# EAGLE design Reflow-controller-ESP32 (EAGLE 9.3.0)
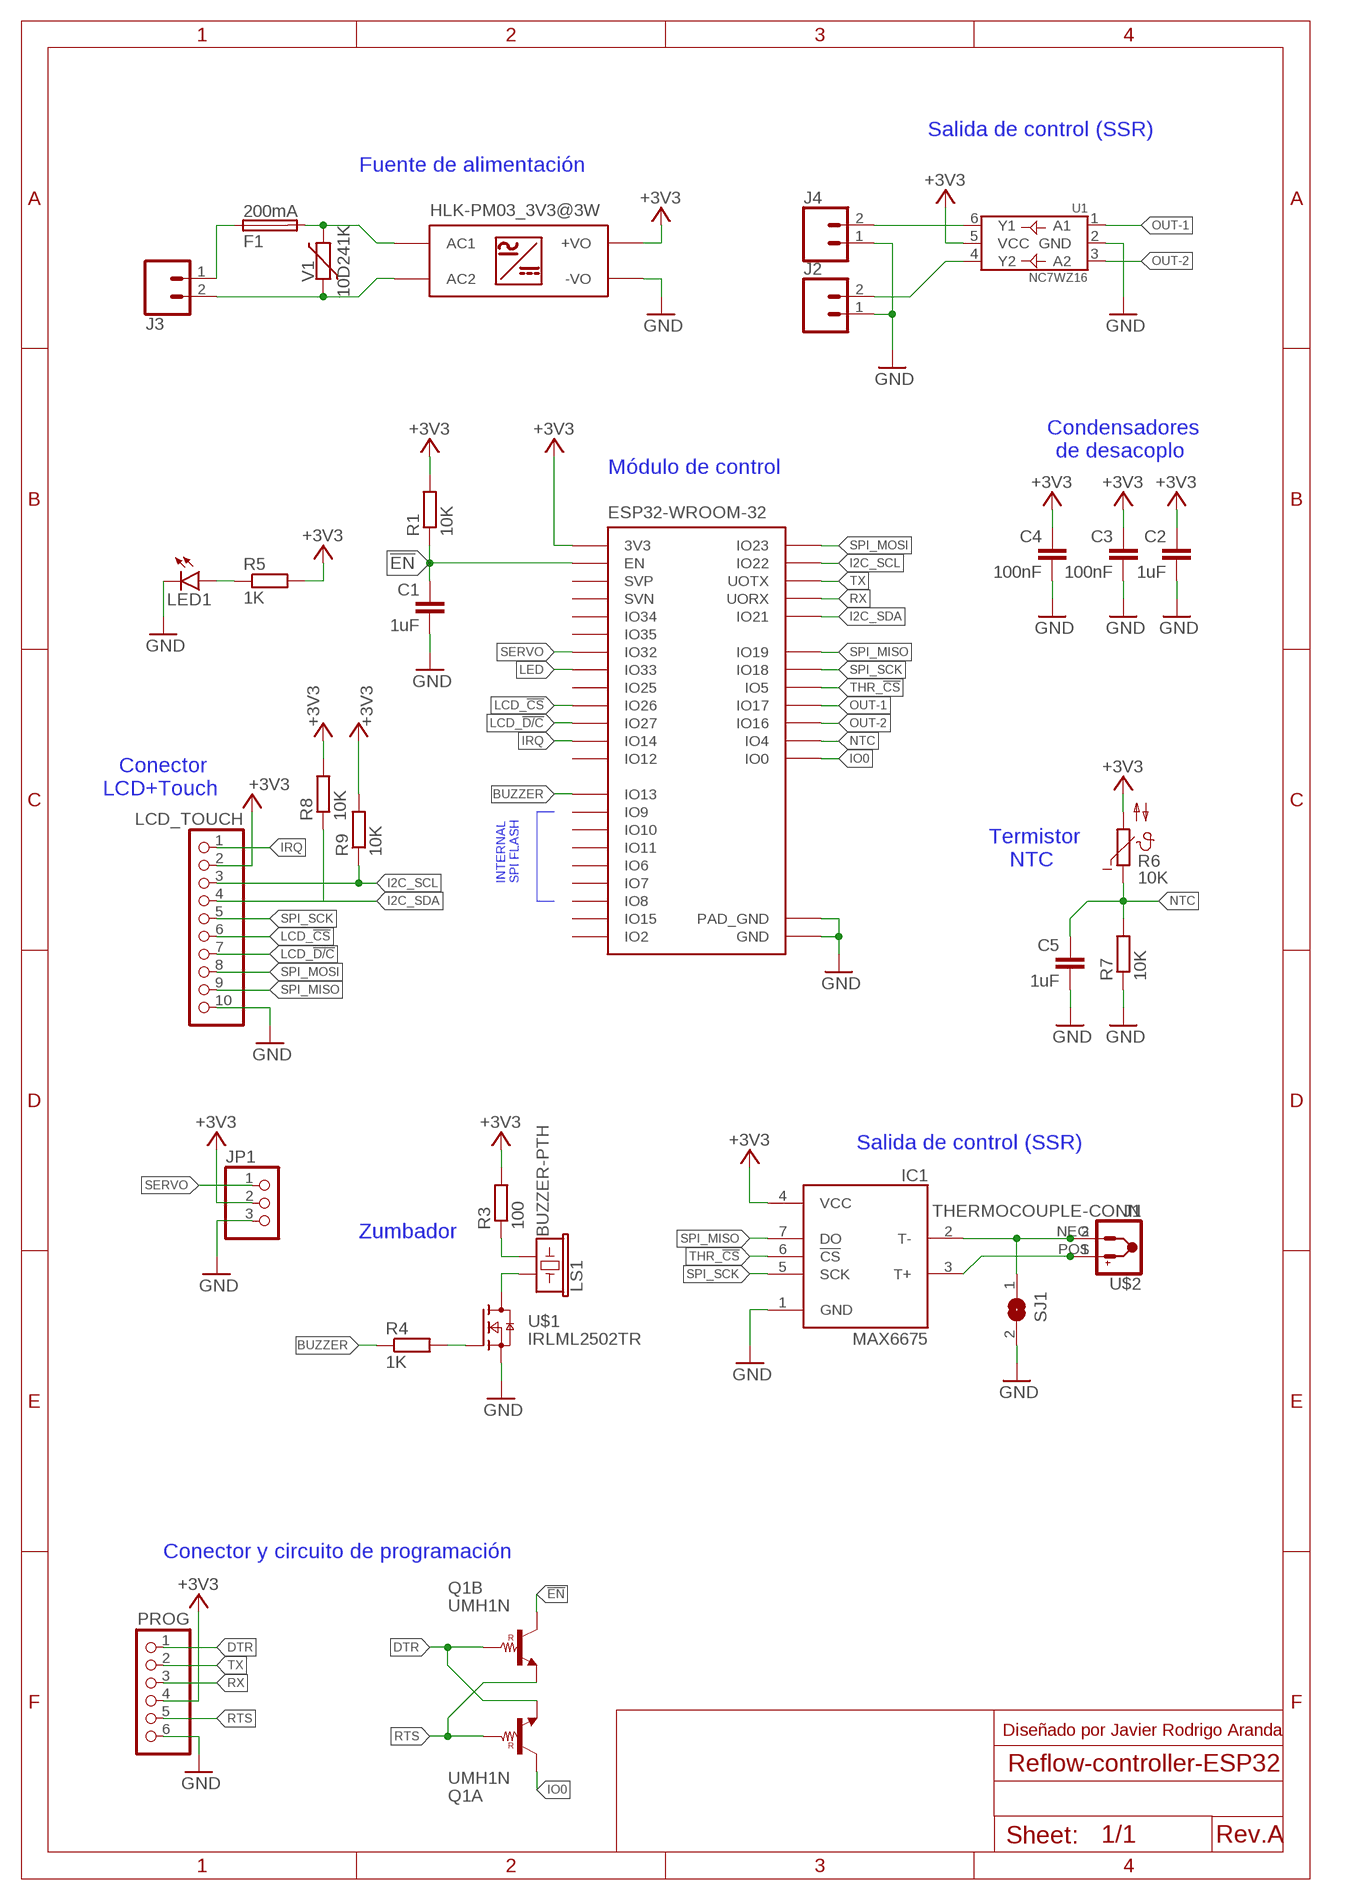
[diagram p0: schematic, sheet 1]

## Parts
C1  1uF  C-EUC0805  [C0805]
C2  1uF  C-EUC0805  [C0805]
C3  100nF  C-EUC0805  [C0805]
C4  100nF  C-EUC0805  [C0805]
C5  1uF  C-EUC0805  [C0805]
ESP32-WROOM-32  ESP32  [ESP32-WROOM-32]
F1  200mA  SH22,5  [SH22,5]
HLK-PM03_3V3@3W  HLK-PM0X  [HLK-PM0X]
IC1  MAX6675  [SO08]
J1  HEADER_01X025MM-BIG  [SCREWTERMINAL-5MM-BIG-BLOCK]
J2  HEADER_01X025MM-BIG  [SCREWTERMINAL-5MM-BIG-BLOCK]
J3  HEADER_01X025MM-BIG  [SCREWTERMINAL-5MM-BIG-BLOCK]
J4  HEADER_01X025MM-BIG  [SCREWTERMINAL-5MM-BIG-BLOCK]
JP1  PINHD-1X3  [1X03]
LCD_TOUCH  PINHD-1X10  [1X10]
LED1  LEDSML1206  [SML1206]
LS1  BUZZER-PTH  [BUZZER-12MM]
PROG  PINHD-1X6  [1X06]
Q1  UMH1N  UMX1N  [UMT6]
R1  10K  R-EU_R0805  [R0805]
R3  100  R-EU_R0805  [R0805]
R4  1K  R-EU_R0805  [R0805]
R5  1K  R-EU_R0805  [R0805]
R6  10K  NTC642-6  [P642]
R7  10K  R-EU_R0805  [R0805]
R8  10K  R-EU_R0805  [R0805]
R9  10K  R-EU_R0805  [R0805]
SJ1  SJ  [SJ]
U1  NC7WZ16  [SC-70-6]
U$1  IRLML2502TR  [SOT23-3]
U$2  THERMOCOUPLE-CONN  [THERMOCOUPLE-ONBOARD-CONN]
V1  10D241K  VARISTOR-7,5  [R-7,5]

## Nets
!EN: C1.1 ESP32-WROOM-32.3(EN) Q1.3(B:C) R1.1
+3V3: C2.1 C3.1 C4.1 ESP32-WROOM-32.2(3V3) HLK-PM03_3V3@3W.P$4(+VO) IC1.4(VCC) JP1.2 LCD_TOUCH.2 PROG.4 R1.2 R3.2 R5.2 R6.2 R8.2 R9.2 U1.5(VCC)
AC+: HLK-PM03_3V3@3W.P$2(AC2) J3.2 V1.1
AC-: F1.2 HLK-PM03_3V3@3W.P$1(AC1) V1.2
BOUT1: J4.2 U1.6(Y1)
BOUT2: J2.2 U1.4(Y2)
BUZZER: ESP32-WROOM-32.16(IO13) R4.1
DTR: PROG.1 Q1.1(A:E) Q1.5(B:B)
GND: C1.2 C2.2 C3.2 C4.2 C5.2 ESP32-WROOM-32.1(GND) ESP32-WROOM-32.15(GND) ESP32-WROOM-32.38(GND) ESP32-WROOM-32.GND(PAD_GND) HLK-PM03_3V3@3W.P$3(-VO) IC1.1(GND) J2.1 J4.1 JP1.3 LCD_TOUCH.10 LED1.C PROG.6 R7.1 SJ1.2 U1.2(GND) U$1.2(S)
I2C_SCL: ESP32-WROOM-32.36(IO22) LCD_TOUCH.3 R9.1
I2C_SDA: ESP32-WROOM-32.33(IO21) LCD_TOUCH.4 R8.1
IO0: ESP32-WROOM-32.25(IO0) Q1.6(A:C)
IRQ: ESP32-WROOM-32.13(IO14) LCD_TOUCH.1
LCD_!CS: ESP32-WROOM-32.11(IO26) LCD_TOUCH.6
LCD_!D/C: ESP32-WROOM-32.12(IO27) LCD_TOUCH.7
LED: ESP32-WROOM-32.9(IO33)
N$2: F1.1 J3.1
N$5: LED1.A R5.1
N$6: IC1.3(T+) J1.1 U$2.POS
N$7: LS1.- R3.1
N$8: LS1.+ U$1.3(D)
N$9: R4.2 U$1.1(G)
N$10: IC1.2(T-) J1.2 SJ1.1 U$2.NEG
NTC: C5.1 ESP32-WROOM-32.26(IO4) R6.1 R7.2
OUT-1: ESP32-WROOM-32.28(IO17) U1.1(A1)
OUT-2: ESP32-WROOM-32.27(IO16) U1.3(A2)
RTS: PROG.5 Q1.2(A:B) Q1.4(B:E)
RX: ESP32-WROOM-32.34(UORX) PROG.3
SERVO: ESP32-WROOM-32.8(IO32) JP1.1
SPI_MISO: ESP32-WROOM-32.31(IO19) IC1.7(DO) LCD_TOUCH.9
SPI_MOSI: ESP32-WROOM-32.37(IO23) LCD_TOUCH.8
SPI_SCK: ESP32-WROOM-32.30(IO18) IC1.5(SCK) LCD_TOUCH.5
THR_!CS: ESP32-WROOM-32.29(IO5) IC1.6(!CS)
TX: ESP32-WROOM-32.35(UOTX) PROG.2
Unconnected: ESP32-WROOM-32.4(SVP) ESP32-WROOM-32.5(SVN) ESP32-WROOM-32.6(IO34) ESP32-WROOM-32.7(IO35) ESP32-WROOM-32.10(IO25) ESP32-WROOM-32.14(IO12) ESP32-WROOM-32.17(IO9) ESP32-WROOM-32.18(IO10) ESP32-WROOM-32.19(IO11) ESP32-WROOM-32.20(IO6) ESP32-WROOM-32.21(IO7) ESP32-WROOM-32.22(IO8) ESP32-WROOM-32.23(IO15) ESP32-WROOM-32.24(IO2)

## Notes on the sheet
- Salida de control (SSR)
- Fuente de alimentación
- Condensadores
  de desacoplo
- Módulo de control
- Conector
  LCD+Touch
- Termistor
  NTC
- INTERNAL
  SPI FLASH
- Salida de control (SSR)
- Zumbador
- Conector y circuito de programación
- Diseñado por Javier Rodrigo Aranda
- Rev.A

## Library data of the parts
C1-C5 = rcl:C-EU: CAPACITOR, European symbol; SPICEPREFIX: C
ESP32-WROOM-32 = jrodrigo:ESP32
F1 = fuse:SH22,5: FUSE HOLDER grid 22,5 mm, OGN0031 8201, Schurter (Buerklin); MF: SCHURTER; MPN: 0031.8201; OC_FARNELL: 1162740; OC_NEWARK: 96F8317
HLK-PM03_3V3@3W = jrodrigo:HLK-PM0X: Hi-Link Power Supply HLK-PM01, HLK-PM02, HLK-PM03, ...
IC1 = jrodrigo:MAX6675
J1-J4 = jrodrigo:HEADER_01X02: Based on Sparkfun part with extra footprints
JP1 = pinhead:PINHD-1X3: PIN HEADER
LCD_TOUCH = pinhead:PINHD-1X10: PIN HEADER
LED1 = led:LED: LED OSRAM: - CHIPLED LG R971, LG N971, LY N971, LG Q971, LY Q971, LO R971, LY R971 LH N974, LH R974 LS Q976, LO Q976, LY Q976 LO Q996 - Hyper CHIPLED LW Q18S LB Q993, LB Q99A, LB R99A - SideLED LS A670, LO A670, LY A670, LG A670, LP A670 LB A673, LV A673, LT A673, LW A673 LH A674 LY A675 LS A676, LA A676, LO A676, LY A676, LW A676 LS A679, LY A679, LG A679 - Hyper Micro SIDELED® LS Y876, LA Y876, LO Y876, LY Y876 LT Y87S - SmartLED LW L88C, LW L88S LB L89C, LB L89S, LG L890 LS L89K, LO L89K, LY L89K LS L896, LA L896, LO L896, LY L896 - TOPLED LS T670, LO T670, LY T670, LG T670, LP T670 LSG T670, LSP T670, LSY T670, LOP T670, LYG T670 LG T671, LOG T671, LSG T671 LB T673, LV T673, LT T673, LW T673 LH T674 LS T676, LA T676, LO T676, LY T676, LB T676, LH T676, LSB T676, LW T676 LB T67C, LV T67C, LT T67C, LS T67K, LO T67K, LY T67K, LW E67C LS E67B, LA E67B, LO E67B, LY E67B, LB E67C, LV E67C, LT E67C LW T67C LS T679, LY T679, LG T679 LS T770, LO T770, LY T770, LG T770, LP T770 LB T773, LV T773, LT T773, LW T773 LH T774 LS E675, LA E675, LY E675, LS T675 LS T776, LA T776, LO T776, LY T776, LB T776 LHGB T686 LT T68C, LB T68C - Hyper Mini TOPLED® LB M676 - Mini TOPLED Santana® LG M470 LS M47K, LO M47K, LY M47K Source: http://www.osram.convergy.de LUXEON: - LUMILED® LXK2-PW12-R00, LXK2-PW12-S00, LXK2-PW14-U00, LXK2-PW14-V00 LXK2-PM12-R00, LXK2-PM12-S00, LXK2-PM14-U00 LXK2-PE12-Q00, LXK2-PE12-R00, LXK2-PE12-S00, LXK2-PE14-T00, LXK2-PE14-U00 LXK2-PB12-K00, LXK2-PB12-L00, LXK2-PB12-M00, LXK2-PB14-N00, LXK2-PB14-P00, LXK2-PB14-Q00 LXK2-PR12-L00, LXK2-PR12-M00, LXK2-PR14-Q00, LXK2-PR14-R00 LXK2-PD12-Q00, LXK2-PD12-R00, LXK2-PD12-S00 LXK2-PH12-R00, LXK2-PH12-S00 LXK2-PL12-P00, LXK2-PL12-Q00, LXK2-PL12-R00 Source: www.luxeon.com KINGBRIGHT: KA-3528ASYC Source: www.kingbright.com
LS1 = SparkFun-Electromechanical:BUZZER: Buzzer Small round buzzers that operate around the audible 2kHz range. You can use these as speakers to create simple music or user interfaces. Variant Overview: PTH - Mini Speaker - PC Mount 12mm 2.048kHz <https://www.sparkfun.com/products/7950> PTH_KIT - Mini Speaker - PC Mount 12mm 2.048kHz <https://www.sparkfun.com/products/7950> KIT simplifies soldering by adding stop mask to one side of the pads. PTH_NO_SILK - Mini Speaker - PC Mount 12mm 2.048kHz <https://www.sparkfun.com/products/7950> No silkscreen indicator of buzzer outline. PTH_KIT_NO_SILK - Mini Speaker - PC Mount 12mm 2.048kHz <https://www.sparkfun.com/products/7950> KIT package w/o silkscreen SMD - Buzzer Audio Magnetic (CCV-084B16) SMD buzzer used on, e.g. the LilyPad Buzzer <https://www.sparkfun.com/products/8463> and RFID USB Reader <https://www.sparkfun.com/products/9963>. SMD_KIT - Buzzer Audio Magnetic (CCV-084B16) SMD Buzzer with elongated pins to make soldering easier. Used on the SparkFun Simon Says - Surface Mount Soldering Kit <https://www.sparkfun.com/products/10935>.; PROD_ID: COMP-08253; SF_SKU: COM-07950
PROG = pinhead:PINHD-1X6: PIN HEADER
Q1 = jrodrigo:UMX1N: General purpose transistors (dual transistors) Two 2SC2412K chips in a EMT or UMT or SMT package. Source: http://www.rohm.com/products/databook/tr/pdf/umx1n.pdf; MPN: UMX1NTN; OC_FARNELL: 1680410; OC_NEWARK: 40P3417
R1 R3-R5 R7-R9 = rcl:R-EU_: RESISTOR, European symbol; SPICEPREFIX: R
R6 = ptc-ntc:NTC642-6: PHILIPS NTC; OC_FARNELL: unknown; OC_NEWARK: unknown
SJ1 = jumper:SJ: SMD solder JUMPER
U1 = jrodrigo:NC7WZ16
U$1 = jrodrigo:IRLML2502TR
U$2 = jrodrigo:THERMOCOUPLE-CONN
V1 = varistor:VARISTOR: VARISTOR

## Board
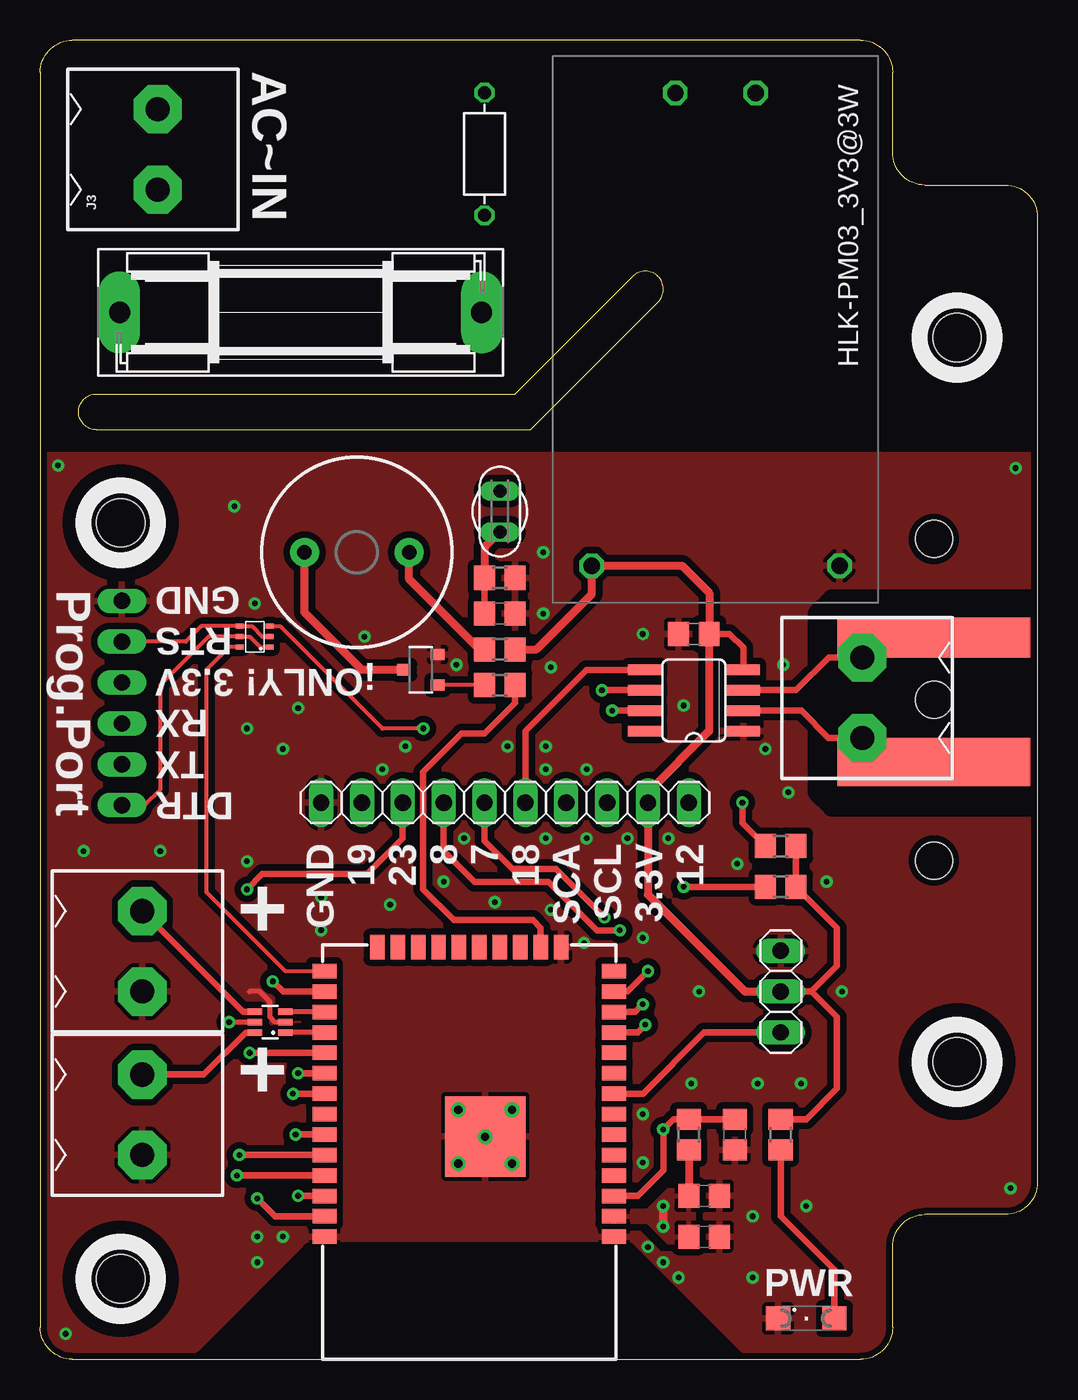
[diagram p1: board, top side]
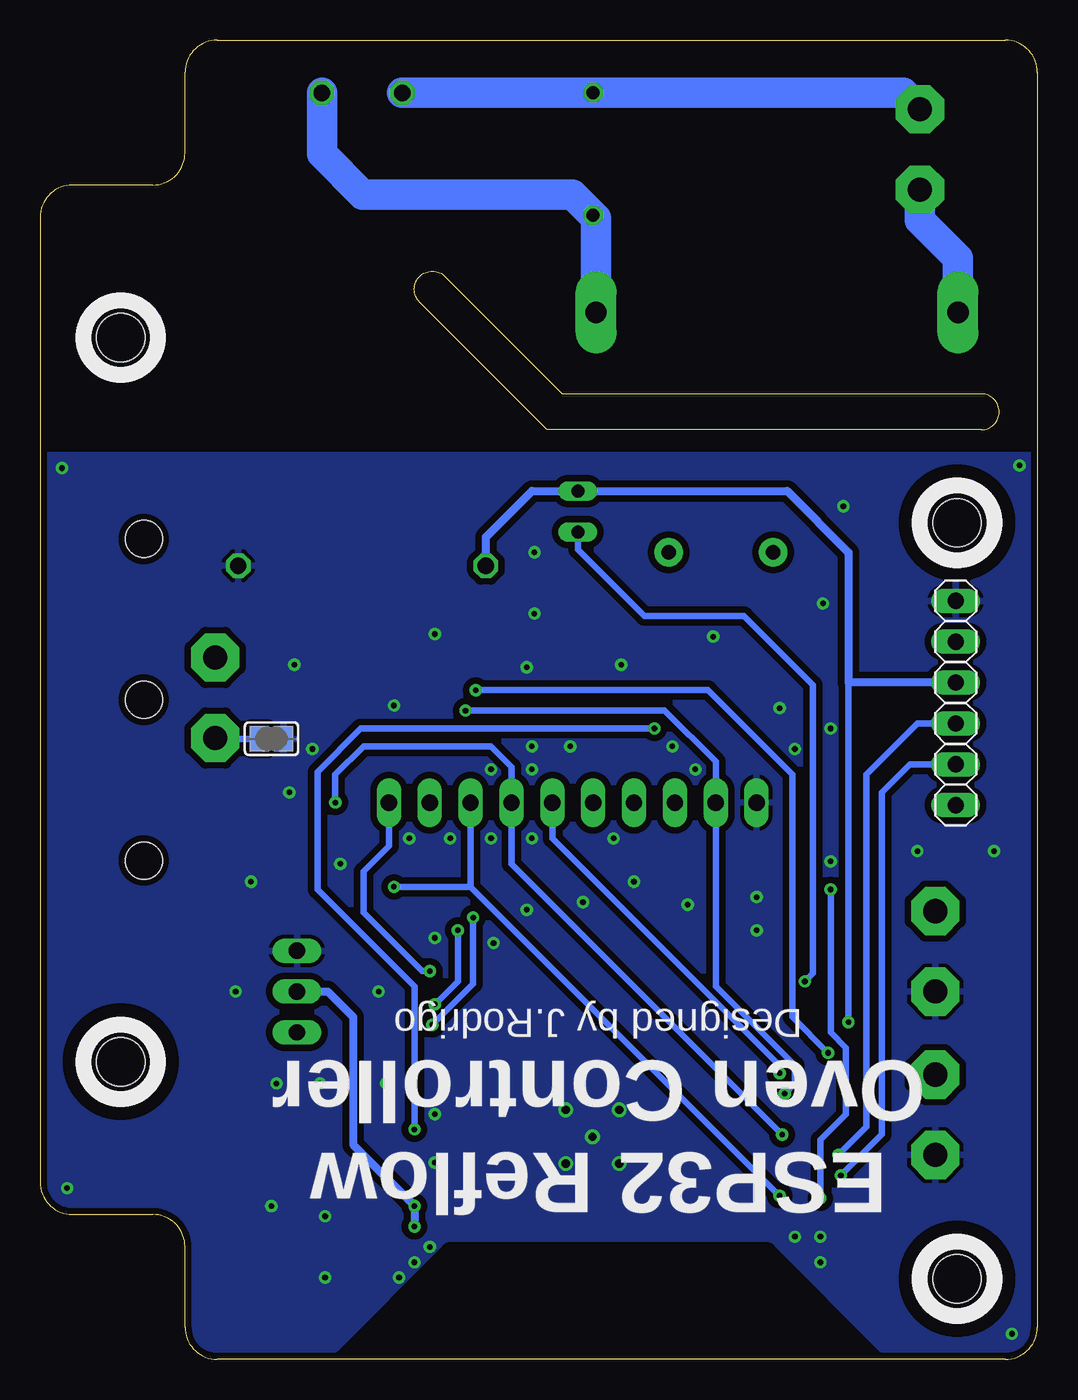
[diagram p2: board, bottom side, seen from below]

Size 62 x 82 mm. Coordinates in mm from the lower left corner, seen from the top.
Outline: 2,0 51,0 arc90 53,2 53,7 arc-90 55,9 60,9 arc90 62,11 62,71 arc90 60,73 55,73 arc-90 53,75 53,80 arc90 51,82 2,82 arc90 0,80 0,2 arc90 2,0
Outline: 3.49,60.01 29.53,60.01 36.83,67.31 arc-180 38.42,65.72 30.48,57.78 3.49,57.78 arc-180 3.49,60.01
Copper layers (1*16): Top 0.035mm / dielectric 1.5mm / Bottom 0.035mm
Design rules "Piwae_PCBway": minimum track width 4mil, minimum drill 6mil, track to track 8mil, track to pad 8mil, pad to pad 8mil, via to via 8mil, smd to smd 8mil, copper to edge 10mil, drill to drill 8mil, minimum pad ring 8mil, minimum via ring 8mil, stop-mask expansion 4mil, vias tented up to drill 25mil, thermal gap 10mil
Holes 3 mm at 57,63.5 57,18.5 5,5 5,52
tRestrict: area 2,2 to 8,8; area 2,49 to 8,55; area 54,15.5 to 60,21.5; 8 lines
bRestrict: area 2,2 to 8,8; area 2,49 to 8,55; area 54,15.5 to 60,21.5; 3 lines

### Footprints (pad centres in the part's own frame; a part is rotated, then mirrored left to right if it is on the bottom)
C0805 = smd 1.3 x 1.5: 1 -0.95,0; 2 0.95,0
ESP32-WROOM-32 = smd 1.5 x 0.9: 1 -9,6.985; 2 -9,5.715; 3 -9,4.445; 4 -9,3.175; 5 -9,1.905; 6 -9,0.635; 7 -9,-0.635; 8 -9,-1.905; 9 -9,-3.175; 10 -9,-4.445; 11 -9,-5.715; 12 -9,-6.985; 13 -9,-8.255; 14 -9,-9.525; 25 9,-9.525; 26 9,-8.255; 27 9,-6.985; 28 9,-5.715; 29 9,-4.445; 30 9,-3.175; 31 9,-1.905; 32 9,-0.635; 33 9,0.635; 34 9,1.905; 35 9,3.175; 36 9,4.445; 37 9,5.715; 38 9,6.985 | smd 0.9 x 1.5: 15 -5.715,-11.015; 16 -4.445,-11.015; 17 -3.175,-11.015; 18 -1.905,-11.015; 19 -0.635,-11.015; 20 0.635,-11.015; 21 1.905,-11.015; 22 3.175,-11.015; 23 4.445,-11.015; 24 5.715,-11.015 | smd 5 x 5: GND -1,0.755
SH22,5 = drill 1.321 pad 2.54 long: 1 -11.252,0; 2 11.252,0
HLK-PM0X = drill 1.016 octagon: P$1 -14.7,2.5; P$2 -14.7,-2.5; P$3 14.7,7.7; P$4 14.7,-7.7
SO08 = smd 0.66 x 2.032: 1 -1.905,-3.073; 2 -0.635,-3.073; 3 0.635,-3.073; 4 1.905,-3.073; 5 1.905,3.073; 6 0.635,3.073; 7 -0.635,3.073; 8 -1.905,3.073
SCREWTERMINAL-5MM-BIG-BLOCK = drill 1.5 pad 3 octagon: 1 0,0; 2 5,0
1X03 = drill 1.016 long: 1 -2.54,0; 2 0,0; 3 2.54,0
1X10 = drill 1.016 long: 1 -11.43,0; 2 -8.89,0; 3 -6.35,0; 4 -3.81,0; 5 -1.27,0; 6 1.27,0; 7 3.81,0; 8 6.35,0; 9 8.89,0; 10 11.43,0
SML1206 = smd 1.5 x 1.5: A 1.75,0; C -1.75,0
BUZZER-12MM = drill 0.9 pad 1.778: + 3.25,0; - -3.25,0
1X06 = drill 1.016 long: 1 -6.35,0; 2 -3.81,0; 3 -1.27,0; 4 1.27,0; 5 3.81,0; 6 6.35,0
UMT6 = smd 0.5 x 0.3: 1 -0.925,0.65; 2 -0.925,0; 3 -0.925,-0.65; 4 0.925,-0.65; 5 0.925,0; 6 0.925,0.65
R0805 = smd 1.3 x 1.5: 1 -0.95,0; 2 0.95,0
P642 = drill 0.813 long: 1 -1.27,0; 2 1.27,0
SJ = smd 1.168 x 1.6: 1 -0.762,0; 2 0.762,0
SC-70-6 = smd 0.9 x 0.4: 1 -0.95,0.65; 2 -0.95,0; 3 -0.95,-0.65; 4 0.95,-0.65; 5 0.95,0; 6 0.95,0.65
SOT23-3 = smd 0.7 x 0.85: 1 -0.95,-1.05; 2 0.95,-1.05; 3 0,1.05
THERMOCOUPLE-ONBOARD-CONN = smd 3 x 12: NEG -3.875,0 | smd 2.5 x 12: POS 3.875,0 | hole 2.3: 0,0; 10,0; -10,0
R-7,5 = drill 0.813 octagon: 1 -3.81,0; 2 3.81,0

### Placement (x,y rotation side)
C1  43.18,13.97 270 top
C2  41.27,7.62 0 top
C3  41.27,10.16 0 top
C4  40.64,45.09 180 top
C5  28.57,46.35 0 top
ESP32-WROOM-32  26.67,14.61 180 top
F1  16.19,65.09 0 top
HLK-PM03_3V3@3W  41.99,64.03 270 top
IC1  40.64,40.96 90 top
J1  51.12,43.62 270 top
J2  6.35,22.86 90 top
J3  7.3,72.71 90 top
J4  6.35,12.7 90 top
JP1  46.04,22.86 90 top
LCD_TOUCH  28.89,34.61 180 top
LED1  47.62,2.54 0 top
LS1  19.68,50.16 180 top
PROG  5.08,40.8 90 bottom
Q1  13.34,44.93 180 top
R1  40.32,13.97 270 top
R3  28.57,44.13 0 top
R4  28.57,41.91 180 top
R5  46.04,13.97 90 top
R6  28.57,52.7 90 top
R7  28.57,48.58 180 top
R8  46.04,31.91 0 top
R9  46.04,29.37 0 top
SJ1  47.62,38.58 0 bottom
U1  14.29,20.95 180 top
U$1  23.65,42.86 90 top
U$2  55.56,41 90 top
V1  27.62,74.93 270 top

### Tracks (layer width: path | path; a pad name or v marks a point on that pad's centre or on a via)
!EN  (via drill 0.35)
  Top 0.254: Q1.3 14.91,45.58 21.27,39.21 v23.81,39.21
  Top 0.406: C1.1 R1.1 39.37,14.92 v38.73,14.29 38.73,11.75 37.15,10.16 ESP32-WROOM-32.3
  Bottom 0.406: v23.81,39.21 42.07,39.21 44.77,36.51 44.77,29.21 38.73,23.18 v38.73,14.29
+3V3  (via drill 0.35)
  Top 0.305: U1.5 v11.75,20.95
  Top 0.406: IC1.4 43.71,44.23 42.86,45.09 C4.1 | R1.2 | 47.94,22.86 49.53,21.27 49.53,16.83 47.62,14.92 R5.2 | JP1.2 47.94,22.86 | 47.94,22.86 49.53,24.45 49.53,26.83 R9.2 R8.2
  Top 0.508: R3.2 30.84,44.13 34.29,47.58 HLK-PM03_3V3@3W.P$4 39.89,49.33 41.59,47.62 C4.1 41.59,39.05 37.78,35.24 LCD_TOUCH.2 37.78,28.89 43.81,22.86 JP1.2 | R1.2 C3.1 | v38.73,8.26 v38.73,9.53
  Bottom 0.406: 11.75,42.07 v11.75,20.95
  Bottom 0.508: JP1.2 44.13,22.86 42.55,21.27 42.55,13.34 v38.73,9.53 v38.73,8.26 | PROG.4 11.75,42.07 11.75,50.16 15.56,53.98 R6.2 31.43,53.98 34.29,51.12 HLK-PM03_3V3@3W.P$4
  pour Top: 35.56,8.57 37.78,8.57 39.05,7.3 40.64,7.3 40.64,10.48 39.05,10.48 37.78,9.21 35.56,9.21
AC+
  Bottom 1.905: J3.2 8.34,78.74 V1.1 27.64,78.73 HLK-PM03_3V3@3W.P$2
AC-
  Bottom 1.905: F1.2 27.45,70.94 V1.2 28.89,72.39 41.95,72.39 44.49,74.93 HLK-PM03_3V3@3W.P$1
BOUT1
  Top 0.406: U1.6 12.77,20.3 10.16,17.7 J4.2
BOUT2
  Top 0.406: U1.4 12.61,21.61 J2.2
BUZZER
  Top 0.406: R4.1 29.52,40.8 27.62,38.89 26.19,38.89 23.81,36.51 23.81,29.21 25.72,27.3 30.64,27.3 31.11,26.83 ESP32-WROOM-32.16
DTR
  Top 0.254: Q1.1 13.67,44.28 13.02,44.93 Q1.5 10.48,44.93 7.46,41.91 7.46,35.4 6.51,34.45 PROG.1
GND  (via drill 0.35, 0.51)
  Top 0.305: U1.2 14.61,20.95 14.29,21.27 14.29,22.23 13.65,22.86 13.02,22.86
  Bottom 0.305: 46.99,38.58 48.26,38.58
  other vias: 26,12.17 29.33,12.17 29.33,15.5 26,15.5 27.66,13.83 31.27,46.35 31.27,50.16 33.97,32.38 31.43,32.38 36.51,32.38 33.97,36.67 31.43,36.67 21.27,36.67 22.7,38.1 29.05,38.1 31.43,38.1 28.26,28.42 31.75,27.94 15.08,7.62 13.49,7.62 13.49,6.03 37.78,6.99 38.73,6.03 39.69,5.08 47.62,9.53 44.29,8.89 44.29,5.08 40.48,17.14 44.61,17.14 47.31,17.14 37.47,15.24 37.47,12.22 37.47,26.19 49.85,22.86 48.9,29.69 46.51,35.24 45.09,37.94 40.01,40.64 37.47,45.09 31.75,43.02 13.34,46.99 12.06,53.02 1.11,55.56 1.59,1.59 60.33,10.64 60.64,55.4 46.2,43.18 7.46,31.59 2.7,31.59 26.35,32.38 21.75,28.26 17.46,28.73 17.46,26.67 12.86,30.96 12.86,39.21 15.08,37.94 16.03,40.48 20.16,44.93 25.88,43.18 43.34,30.8 39.05,32.38 40.96,22.86 25.08,29.69 33.81,25.88
  pour Top (isolate 0.406, rank 2): 0,0 0,56.2 61.91,56.2 61.91,9.53 52.39,0
  pour Bottom (isolate 0.406, rank 2): 0,0 0,56.2 61.91,56.2 61.91,9.84 52.07,0
I2C_SCL  (via drill 0.35)
  Top 0.406: R9.1 v40.01,29.37 | v16.03,10.16 ESP32-WROOM-32.36
  Bottom 0.406: LCD_TOUCH.3 35.24,29.37 | 35.24,29.37 v16.03,10.16 | v40.01,29.37 35.24,29.37
I2C_SDA  (via drill 0.35)
  Top 0.406: R8.1 43.66,33.34 v43.66,34.61 | v15.88,13.97 ESP32-WROOM-32.33
  Bottom 0.406: v15.88,13.97 32.7,30.8 LCD_TOUCH.4 32.7,36.83 33.97,38.1 41.91,38.1 43.66,36.35 v43.66,34.61
IO0
  Top 0.254: Q1.6 11.73,44.28 10.32,42.86 10.32,29.05 15.24,24.13 ESP32-WROOM-32.25
IRQ  (via drill 0.35)
  Top 0.406: ESP32-WROOM-32.13 36.51,22.86 v37.78,24.13
  Bottom 0.406: LCD_TOUCH.1 40.32,31.91 41.91,30.32 41.91,27.78 38.26,24.13 v37.78,24.13
LCD_!CS  (via drill 0.35)
  Top 0.406: ESP32-WROOM-32.11 37.15,20.32 v37.62,20.8 | LCD_TOUCH.6 27.62,32.23 29.37,30.48 32.07,30.48 v35.08,27.46
  Bottom 0.406: v37.62,20.8 35.08,23.34 v35.08,27.46
LCD_!D/C  (via drill 0.35)
  Top 0.406: ESP32-WROOM-32.12 36.99,21.59 v37.47,22.07 | v36.04,26.67 34.61,26.67 31.59,29.69 26.99,29.69 25.08,31.59 LCD_TOUCH.7
  Bottom 0.406: v37.47,22.07 36.04,23.5 v36.04,26.67
N$2
  Bottom 1.905: J3.1 7.3,70.8 4.94,68.44 F1.1
N$5
  Top 0.406: R5.1 46.04,8.89 49.38,5.55 LED1.A
N$6
  Top 0.305: U$2.POS 52.37,44.88 J1.1
  Top 0.406: IC1.3 46.99,41.59 49.02,43.62 J1.1
N$7
  Top 0.508: R3.1 27.3,44.13 22.93,48.5 LS1.-
N$8
  Top 0.508: U$1.3 20,42.86 16.43,46.43 LS1.+
N$9
  Top 0.254: R4.2 27.61,41.93 U$1.1
N$10
  Top 0.305: U$2.NEG 52.61,37.12 J1.2
  Top 0.406: IC1.2 47.31,40.32 49.01,38.62 J1.2
  Bottom 0.406: SJ1.1 51.07,38.58 J1.2
NTC  (via drill 0.35)
  Top 0.406: R7.2 C5.1 | v14.46,23.5 15.09,22.86 ESP32-WROOM-32.26
  Top 0.508: R6.1 27.62,50.48 R7.2
  Bottom 0.406: R6.1 28.57,50.32 24.45,46.2 18.26,46.2 13.97,41.91 13.97,23.98 v14.46,23.5
OUT-1
  Top 0.305: U1.1 15.25,20.32 ESP32-WROOM-32.28
OUT-2
  Top 0.305: ESP32-WROOM-32.27 17.66,21.61 U1.3
RTS
  Top 0.254: Q1.2 13.81,44.93 13.16,45.58 Q1.4 10.02,45.58 9.05,44.61 PROG.5
RX  (via drill 0.35)
  Top 0.406: v12.38,12.7 ESP32-WROOM-32.34
  Bottom 0.406: PROG.3 7.46,39.53 10.64,36.35 10.64,14.45 v12.38,12.7
SERVO
  Top 0.406: ESP32-WROOM-32.8 37.47,16.51 41.27,20.32 JP1.1
SPI_MISO  (via drill 0.35)
  Top 0.406: IC1.7 v35.56,40.32 | v15.72,16.51 ESP32-WROOM-32.31
  Bottom 0.406: v35.56,40.32 23.18,40.32 20,37.15 LCD_TOUCH.9 20,23.18 15.08,18.26 15.08,17.14 v15.72,16.51
SPI_MOSI  (via drill 0.35)
  Top 0.406: v12.86,29.21 13.81,30.16 20.32,30.16 22.54,32.38 LCD_TOUCH.8 | v13.49,10 14.61,8.89 ESP32-WROOM-32.37
  Bottom 0.406: v12.86,29.21 12.86,20.32 11.91,19.37 11.91,15.24 13.49,13.65 v13.49,10
SPI_SCK  (via drill 0.35)
  Top 0.406: IC1.5 33.97,42.86 30.16,39.05 LCD_TOUCH.5 | v16.03,17.78 ESP32-WROOM-32.30
  Bottom 0.406: LCD_TOUCH.5 30.16,32.38 16.03,18.26 v16.03,17.78
THR_!CS  (via drill 0.35)
  Top 0.406: IC1.6 v34.92,41.59 | v13.02,19.05 ESP32-WROOM-32.29
  Bottom 0.406: v34.92,41.59 20.48,41.59 15.24,36.35 15.24,21.27 v13.02,19.05
TX  (via drill 0.35)
  Top 0.406: v12.22,11.43 ESP32-WROOM-32.35
  Bottom 0.406: PROG.2 7.94,36.99 9.68,35.24 9.68,13.97 v12.22,11.43

### Text on the board
tNames: AC~IN | Prog.Port | DTR / TX / RX / ¡ONLY! 3.3V / RTS / GND | GND / 19 / 23 / 8 / 7 / 18 / SCA / SCL / 3.3V / 12 | + | + | PWR
bNames: Designed by J.Rodrigo | ESP32 Reflow / Oven Controller